# Altium schematic sheet St1x_V01.SchDoc: St1x
size A4 portrait; DrawnBy: Leon.Mao; Engineer: Leon.Mao; Address3: Building 1, No. 52, DongFeng Nanshe road, Humen Town, Dongguan City,; DocumentNumber: 1; Revision: V01; SheetNumber: 1; SheetTotal: 1
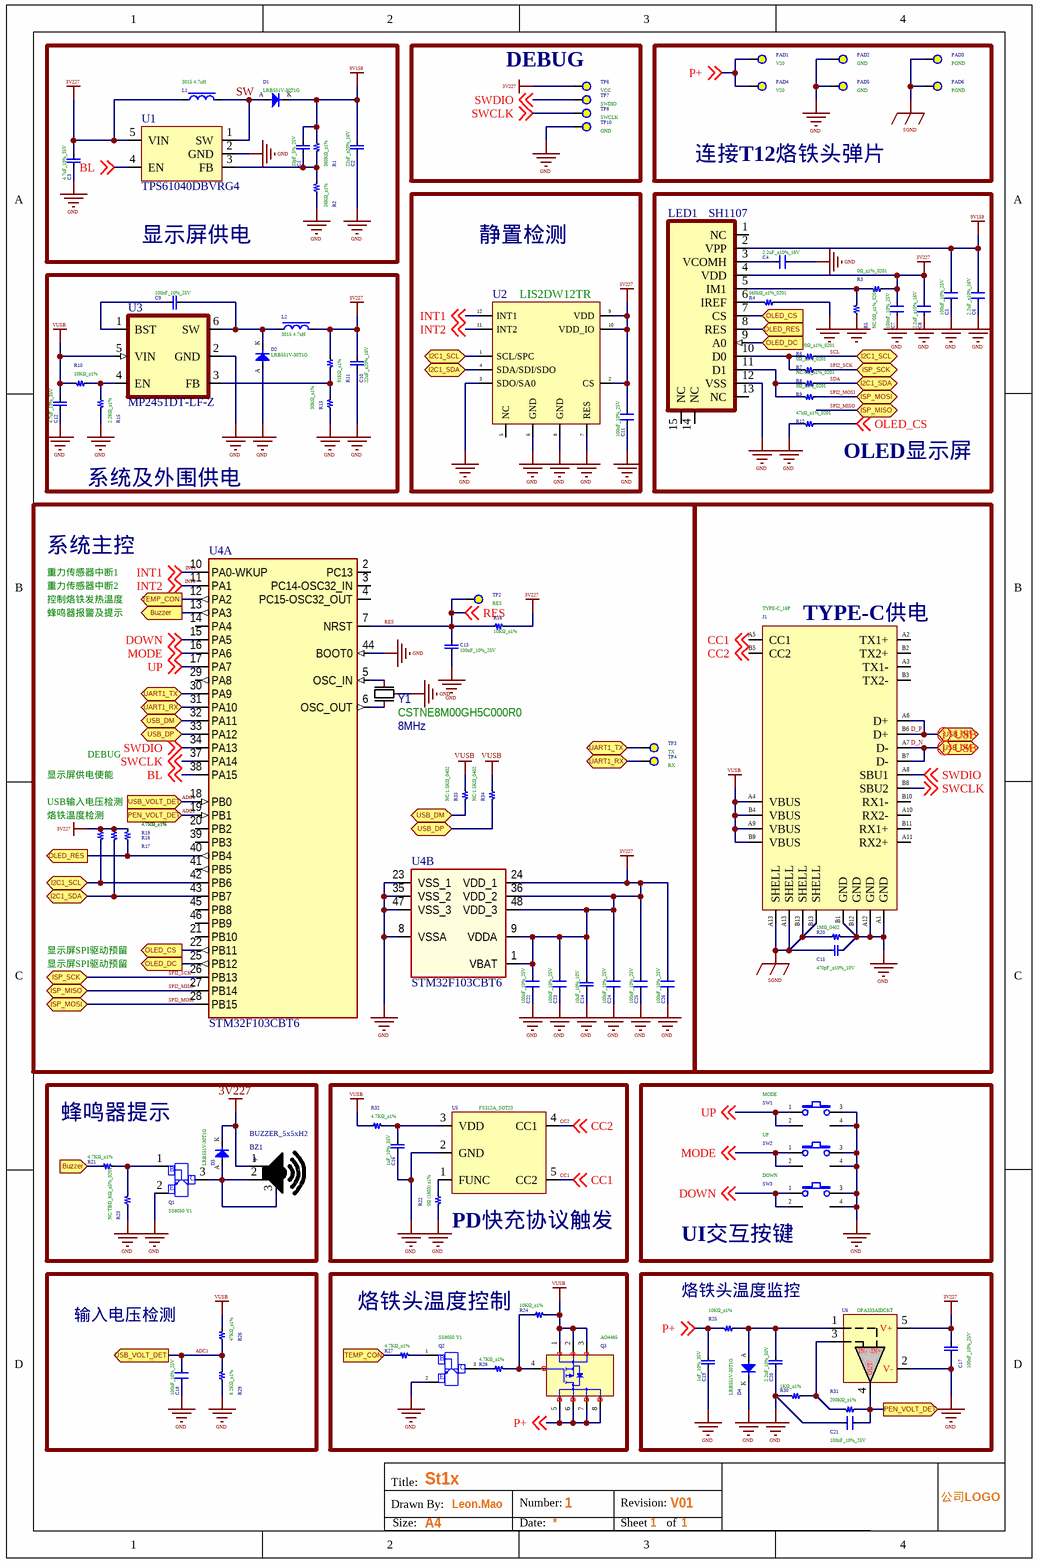
[diagram p0: St1x_V01.SchDoc]

## Parts
BZ1  BUZZER_5x5xH2  [BUZ-SMD_GSC5025YA]
C1  33pF_5%_25V  [C1U0402]
C2  22uF_±20%_16V  [CL0603]
C3  4.7uF_10%_35V  [C4U0402]
C4  2.2uF_±10%_16V  [C4U0402]
C5  100nF_10%_25V  [C1U0402]
C6  2.2uF_±10%_16V  [C4U0402]
C7  100nF_10%_25V  [C1U0402]
C8  2.2uF_±10%_16V  [C4U0402]
C9  100nF_10%_25V  [C1U0402]
C10  22uF_±20%_16V  [CL0603]
C11  100nF_10%_25V  [C1U0402]
C12  4.7uF_10%_35V  [C4U0402]
C13  100nF_10%_25V  [C1U0402]
C14  10uF_10%_10V  [C4U0402]
C15  470pF_±10%_10V  [C0402]
C16  1uF_10%_35V  [C1U0402]
C17  100nF_10%_25V  [C1U0402]
C18  100nF_10%_25V  [C1U0402]
C19  1uF_10%_35V  [C1U0402]
C20  2.2nF_10%_50V  [C4U0402]
C21  100nF_10%_25V  [C1U0402]
C22  100nF_10%_25V  [C1U0402]
C23  100nF_10%_25V  [C1U0402]
C24  100nF_10%_25V  [C1U0402]
C25  100nF_10%_25V  [C1U0402]
C26  100nF_10%_25V  [C1U0402]
D1  LRB551V-30T1G  [SOD-323_AK]
D2  LRB551V-30T1G  [SOD-323_AK]
D3  LRB551V-30T1G  [SOD-323_AK]
D4  LRB551V-30T1G  [SOD-323_AK]
J1  TYPE-C_16P  [TYPE-C_16P]
L1  3015 4.7uH  [INDC3015]
L2  3015 4.7uH  [INDC3015]
LED1  SH1107  [CON_13P_0.7mm-FPC]
PAD1  V20  [TP_A]
PAD2  GND  [TP_A]
PAD3  PGND  [TP_A]
PAD4  V20  [TP_A]
PAD5  GND  [TP_A]
PAD6  PGND  [TP_A]
Q1  SS8050 Y1  [SOT-23_123]
Q2  SS8050 Y1  [SOT-23_123]
Q3  AO4485  [SO-8M]
R1  360KΩ_±1%  [RN0402]
R2  56KΩ_±1%  [RN0402]
R3  0Ω_±1%_0201  [RN0402]
R4  560kΩ_±1%_0201  [RN0402]
R5  NC/0Ω_±1%_0201  [RN0402]
R6  NC/0Ω_±1%_0201  [RN0402]
R7  0Ω_±1%_0201  [RN0402]
R8  NC/0Ω_±1%_0201  [RN0402]
R9  0Ω_±1%_0201  [RN0402]
R10  10KΩ_±1%  [RN0402]
R11  91KΩ_±1%  [RN0402]
R12  47kΩ_±1%_0201  [RN0402]
R13  30KΩ_±1%  [RN0402]
R15  2.2KΩ_±1%  [RN0402]
R16  10KΩ_±1%  [RN0402]
R17  4.7KΩ_±1%  [RN0402]
R18  4.7KΩ_±1%  [RN0402]
R19  4.7KΩ_±1%  [RN0402]
R20  1MΩ_0402  [RN0402]
R21  4.7KΩ_±1%  [RN0402]
R22  0Ω (1803) ±1%  [RN0402]
R23  NC/TBD_KΩ_±5%_0201  [RN0402]
R24  10KΩ_±1%  [RN0402]
R25  10KΩ_±1%  [RN0402]
R26  47KΩ_±1%  [RN0402]
R27  4.7KΩ_±1%  [RN0402]
R28  4.7KΩ_±1%  [RN0402]
R29  8.2KΩ_±1%  [RN0402]
R30  1KΩ_±1%  [RN0402]
R31  200KΩ_±1%  [RN0402]
R32  4.7KΩ_±1%  [RN0402]
R33  NC/1.5KΩ_0402  [RN0402]  (no BOM)
R34  NC/1.5KΩ_0402  [RN0402]  (no BOM)
SW1  MODE  [KEY-SMD_4P-L4.2-W3.2-P2.20-LS5.1-TL]
SW2  UP  [KEY-SMD_4P-L4.2-W3.2-P2.20-LS5.1-TL]
SW3  DOWN  [KEY-SMD_4P-L4.2-W3.2-P2.20-LS5.1-TL]
TP2  RES  [SMD0808]  (no BOM)
TP3  TX  [SMD0808]  (no BOM)
TP4  RX  [SMD0808]  (no BOM)
TP6  VCC  [SMD0808]  (no BOM)
TP7  SWDIO  [SMD0808]  (no BOM)
TP8  SWCLK  [SMD0808]  (no BOM)
TP10  GND  [SMD0808]  (no BOM)
U1  TPS61040DBVRG4  [SOT23-5]
U2  LIS2DW12TR  [LGA12_20x20x07]
U3  MP2451DT-LF-Z  [SOT23-6]
U4  STM32F103CBT6  [LQFP48-7x7mm]  (parts A,B of 2)
U5  FS312A_SOT23  [SOT23-5]
U6  OPA333AIDCKT  [SOT23-5]
Y1  CSTNE8M00GH5C000R0  value 8MHz  [OSC-SMD_3P-L3.2-W1.3-P1.20-L]

## Blocks framed on the sheet
显示屏供电: C1-C3 D1 L1 R1 R2 U1
DEBUG: TP6-TP8 TP10
连接T12烙铁头弹片: PAD1-PAD6
静置检测: C11 U2
OLED显示屏: C4-C8 LED1 R3-R9 R12
系统及外围供电: C9 C10 C12 D2 L2 R10 R11 R13 R15 U3
系统主控: C13 C14 C22-C26 R16-R19 R33 R34 TP2-TP4 U4 Y1
TYPE-C供电: C15 J1 R20
蜂鸣器提示: BZ1 D3 Q1 R21 R23
PD快充协议触发: C16 R22 R32 U5
UI交互按键: SW1-SW3
输入电压检测: C18 R26 R29
烙铁头温度控制: Q2 Q3 R24 R27 R28
烙铁头温度监控: C17 C19-C21 D4 R25 R30 R31 U6

## Ports
Buzzer (in), Buzzer (out), I2C1_SCL (bidir), I2C1_SDA (bidir), ISP_MISO (bidir), ISP_MOSI (bidir), ISP_SCK (bidir), OLED_CS (in), OLED_CS (out), OLED_DC (in), OLED_DC (out), OLED_RES (in), OLED_RES (out), PEN_VOLT_DET (in), PEN_VOLT_DET (out), TEMP_CON (in), TEMP_CON (out), UART1_RX (bidir), UART1_TX (bidir), USB_DM (bidir), USB_DP (bidir), USB_VOLT_DET (in), USB_VOLT_DET (out)

## Nets
3V227: BZ1.1(+) C3.2 C7.1 C8.1 C10.2 C11.1 C14.2 C17.2 C22.1 C23.1 C24.1 C25.1 C26.1 D3.K(CATHODE) L1.1 L2.1 LED1.4(VDD) R3.1 R11.1 R16.1 R17.1 R18.2 R19.2 TP6.1 U1.5(VIN) U2.2(CS) U2.9(VDD) U2.10(VDD_IO) U4.1(VBAT) U4.9(VDDA) U4.24(VDD_1) U4.36(VDD_2) U4.48(VDD_3) U6.5(V+)
9V159: C1.2 C2.2 C5.1 C6.1 D1.K(CATHODE) LED1.2(VPP) R1.1
GND: C2.1 C3.1 C4.2 C5.2 C6.2 C7.2 C8.2 C10.1 C11.2 C12.1 C13.2 C14.1 C15.1 C16.1 C17.1 C18.2 C19.2 C20.2 C21.2 C22.2 C23.2 C24.2 C25.2 C26.2 D2.A(ANODE) D4.K(CATHODE) J1.A1(GND) J1.A12(GND) J1.B1(GND) J1.B12(GND) LED1.12(VSS) PAD2.1 PAD5.1 Q1.2(EMITTER) Q2.2(EMITTER) R2.1 R4.1 R5.1 R12.2 R13.1 R15.2 R20.2 R22.2 R23.1 R29.1 R30.2 SW1.3 SW1.4 SW2.3 SW2.4 SW3.3 SW3.4 TP10.1 U1.2(GND) U2.3(SDO/SA0) U2.6(GND) U2.7(RES) U2.8(GND) U3.2(GND) U4.8(VSSA) U4.23(VSS_1) U4.35(VSS_2) U4.44(BOOT0) U4.47(VSS_3) U5.2(GND) U6.2(V-) Y1.2(GND)
SGND: C15.2 J1.A13(SHELL) J1.B13(SHELL) PAD3.1 PAD6.1 R20.1
VUSB: C12.2 J1.A4(VBUS) J1.A9(VBUS) J1.B4(VBUS) J1.B9(VBUS) Q3.1(S) Q3.2(S) Q3.3(S) R10.2 R24.2 R26.2 R32.1 R33.1 R34.1 U3.5(VIN)
ADC1: C18.1 R26.1 R29.2 U4.18(PB0) ; port USB_VOLT_DET
ADC2: C21.1 R31.1 U4.19(PB1) U6.4(OUT) ; port PEN_VOLT_DET
BL: U1.4(EN) U4.38(PA15) ; off-sheet BL
Buzzer: R21.1 U4.13(PA3) ; port Buzzer
CC1: J1.A5(CC1) U5.5(CC2) ; off-sheet CC1
CC2: J1.B5(CC2) U5.4(CC1) ; off-sheet CC2
D_N: J1.A7(D-) J1.B7(D-) R33.2 U4.32(PA11) ; port USB_DM
D_P: J1.A6(D+) J1.B6(D+) R34.2 U4.33(PA12) ; port USB_DP
DOWN: SW3.1 SW3.2 U4.15(PA5) ; off-sheet DOWN
INT1: U2.12(INT1) U4.10(PA0-WKUP) ; off-sheet INT1
INT2: U2.11(INT2) U4.11(PA1) ; off-sheet INT2
MODE: SW2.1 SW2.2 U4.16(PA6) ; off-sheet MODE
OLED_CS: LED1.7(CS) U4.22(PB11) ; port OLED_CS
OLED_CS: R12.1 ; off-sheet OLED_CS  [a separate net that carries the same name]
OLED_DC: LED1.9(A0) U4.25(PB12) ; port OLED_DC
OLED_RES: LED1.8(RES) R17.2 U4.40(PB4) ; port OLED_RES
P+: C19.1 PAD1.1 PAD4.1 Q3.5(D) Q3.6(D) Q3.7(D) Q3.8(D) R25.2 ; off-sheet P+
RES: C13.1 R16.2 TP2.1 U4.7(NRST) ; off-sheet RES
SCL: R6.1 R19.1 U2.1(SCL/SPC) U4.42(PB6) ; port I2C1_SCL
SDA: R8.1 R18.1 U2.4(SDA/SDI/SDO) U4.43(PB7) ; port I2C1_SDA
SPI2_MISO: U4.27(PB14) ; port ISP_MISO
SPI2_MOSI: R9.1 U4.28(PB15) ; port ISP_MOSI
SPI2_SCK: R7.1 U4.26(PB13) ; port ISP_SCK
SW: D1.A(ANODE) L1.2 U1.1(SW)
SWCLK: J1.B8(SBU2) TP8.1 U4.37(PA14) ; off-sheet SWCLK
SWDIO: J1.A8(SBU1) TP7.1 U4.34(PA13) ; off-sheet SWDIO
TEMP_CON: R27.1 U4.12(PA2) ; port TEMP_CON
UART1_RX: TP4.1 U4.31(PA10) ; port UART1_RX
UART1_TX: TP3.1 U4.30(PA9) ; port UART1_TX
UP: SW1.1 SW1.2 U4.17(PA7) ; off-sheet UP
NetBZ1_2: BZ1.2(-) BZ1.3(-) D3.A(ANODE) Q1.3(COLLECTOR)
NetC1_1: C1.1 R1.2 R2.2 U1.3(FB)
NetC4_1: C4.1 LED1.3(VCOMH)
NetC9_1: C9.1 D2.K(CATHODE) L2.2 U3.6(SW)
NetC9_2: C9.2 U3.1(BST)
NetC16_2: C16.2 R32.2 U5.3(VDD)
NetC20_1: C20.1 D4.A(ANODE) R25.1 U6.1(+IN)
NetLED1_5: LED1.5(IM1) R3.2 R5.2
NetLED1_6: LED1.6(IREF) R4.2
NetLED1_10: LED1.10(D0) R6.2 R7.2
NetLED1_11: LED1.11(D1) R8.2 R9.2
NetQ1_1: Q1.1(BASE) R21.2 R23.2
NetQ2_1: Q2.1(BASE) R27.2
NetQ2_3: Q2.3(COLLECTOR) R28.1
NetQ3_4: Q3.4(G) R24.1 R28.2
NetR10_1: R10.1 R15.1 U3.4(EN)
NetR11_2: R11.2 R13.2 U3.3(FB)
NetR22_1: R22.1 U5.1(FUNC)
NetR30_1: R30.1 R31.2 U6.3(-IN)
NetU4_5: U4.5(OSC_IN) Y1.1(OSC1)
NetU4_6: U4.6(OSC_OUT) Y1.3(OSC2)

Not connected (* = marked no-connect by the designer): J1 A2(TX1+) A3(TX1-) A10(RX2-) A11(RX2+) B2(TX2+) B3(TX2-) B10(RX1-) B11(RX1+); LED1 1(NC) 13(NC) 14(NC) 15(NC); U2 5(NC); U4 2(PC13) 3(PC14-OSC32_IN) 4(PC15-OSC32_OUT) 14(PA4) 20(PB2) 21(PB10) 29(PA8) 39(PB3) 41(PB5) 45(PB8) 46(PB9)

## Layout directives
differential pair; differential pair class USB: D_N, D_P

## Notes on the sheet
- 重力传感器中断1
- 重力传感器中断2
- 控制烙铁发热温度
- 蜂鸣器报警及提示
- 显示屏供电使能
- DEBUG
- USB输入电压检测
- 烙铁温度检测
- 显示屏SPI驱动预留
- Title:
- Drawn By:
- Number:
- Revision:
- 公司LOGO
- Size:
- A4
- Date:
- Sheet
- of
- (in symbol NPN) B; C; E
- (in symbol OPA333_SOT23) IN-; IN+

## Library data of the parts
BZ1 = BZ: 电磁无源蜂鸣器(外部驱动)
C1-C14 C16-C26 = CAP_NP: 贴片电容
C15 = CAP NP_1: 贴片电容
D1-D4 = DIODE: 肖特基二极管
J1 = TYPE-C_RI: TYPE-C母座
L1 L2 = INDUCTOR_2: 功率电感
LED1 = SH1107: QG-2880TSWKG01; MF: {'manufacturer': u'Texas Instruments'}; MP: LP2985AIM5-5.0; Availability: Unavailable; Price: None; Package: None; Value: *
PAD1-PAD6 TP2-TP4 TP6-TP8 TP10 = TEST
Q1 Q2 = NPN: NPN三极管
Q3 = AO4485: P沟道 40V 10A
R1-R13 R15-R34 = ResSemi_3: 贴片电阻
SW1-SW3 = SW PUSHBUTTON: 轻触开关
U1 = TPS61040DBVRG4_[C7722]: DC-DC芯片; ComponentLink1Description: 供应商链接; ComponentLink1URL: http://www.szlcsc.com/product/details_8199.html; Package: SOT-23-5; Supplier: LC; SuppliersPartNumber: C7722
U2 = LIS2DW12: G-Senson重力加速度传感器; PCB DECAL: LIS2DW12
U3 = MP2451DT-LF-Z: MF: {'manufacturer': u'Texas Instruments'}; MP: LP2985AIM5-5.0; Availability: Unavailable; Price: None; Package: None; Value: *
U4 = STM32F103CBT6: No Description Available; Mfr_Name: STMicroelectronics; Copyright: Copyright (C) 2023 Ultra Librarian. All rights reserved.; Manufacturer_Part_Number: STM32F103CBT6; RefDes: RefDes; Type: DEV
U5 = FS312A: USB Type-C PD快充协议智能触发芯片
U6 = OPA333_SOT23: ADC
Y1 = CSTNE8M00GH5C000R0: 频率:8MHz;频率容差:±0.07%;内藏负载电容:33pF;谐振阻抗:40Ω;; Manufacturer: muRata(村田); Add into BOM: yes; Frequency Stability: ±0.13%; Frequency Tolerance: ±0.07%; Built-in Load Capacitance: 33pF; Resonant Impedance: 40Ω; NAME: OSC2; NUMBER: 3; Pin Type: IN; Symbol: CSTNE8M00GH5C000R0; Device: CSTNE8M00GH5C000R0; LCSC Part Name: 8MHz ±0.07% 33pF; Supplier Part: C341525; Manufacturer Part: CSTNE8M00GH5C000R0; Supplier Footprint: SMD3213-3P; Datasheet: https://atta.szlcsc.com/upload/public/pdf/source/20181211/C341525_832BA077079E4863A5153C1DB98581D5.pdf; Supplier: LCSC; Convert to PCB: yes; Operating Temperature: -40~+125